# EAGLE schematic TLV2462CP (EAGLE 7.5.0)

## Sheet 1 of 2

## Sheet 2 of 2
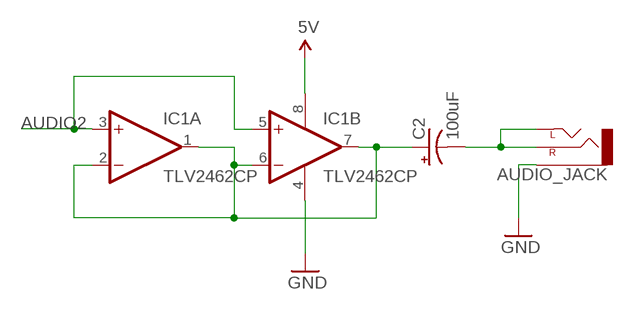
[diagram p0: schematic, sheet 2]

### Parts
AUDIO_JACK  AUDIO-JACKPTH  [AUDIO-JACK]
C2  100uF  CAP_POLPTH1  [CPOL-RADIAL-100UF-25V]
IC1  TLV2462CP  TL072P  [DIL08]

### Nets
5V: IC1.8(P:V+)
AUDIO2: IC1.3(A:+IN) IC1.5(B:+IN)
GND: AUDIO_JACK.SLEEVE IC1.4(P:V-)
N$4: C2.1(+) IC1.1(A:OUT) IC1.2(A:-IN) IC1.6(B:-IN) IC1.7(B:OUT)
N$5: AUDIO_JACK.RING(RIGHT) AUDIO_JACK.TIP(LEFT) C2.2(-)

## Library data of the parts
AUDIO_JACK = SparkFun-Connectors:AUDIO-JACK: 3.5mm Audio Jack Simple 3.5mm common PCB mount audio jack. SKU: PRT-08032
C2 = SparkFun-Capacitors:CAP_POL: Capacitor Polarized These are standard SMD and PTH capacitors. Normally 10uF, 47uF, and 100uF in electrolytic and tantalum varieties. Always verify the external diameter of the through hole cap, it varies with capacity, voltage, and manufacturer. The EIA devices should be standard.
IC1 = linear:TL072: OP AMP